# Altium schematic sheet ADC.SchDoc
size A
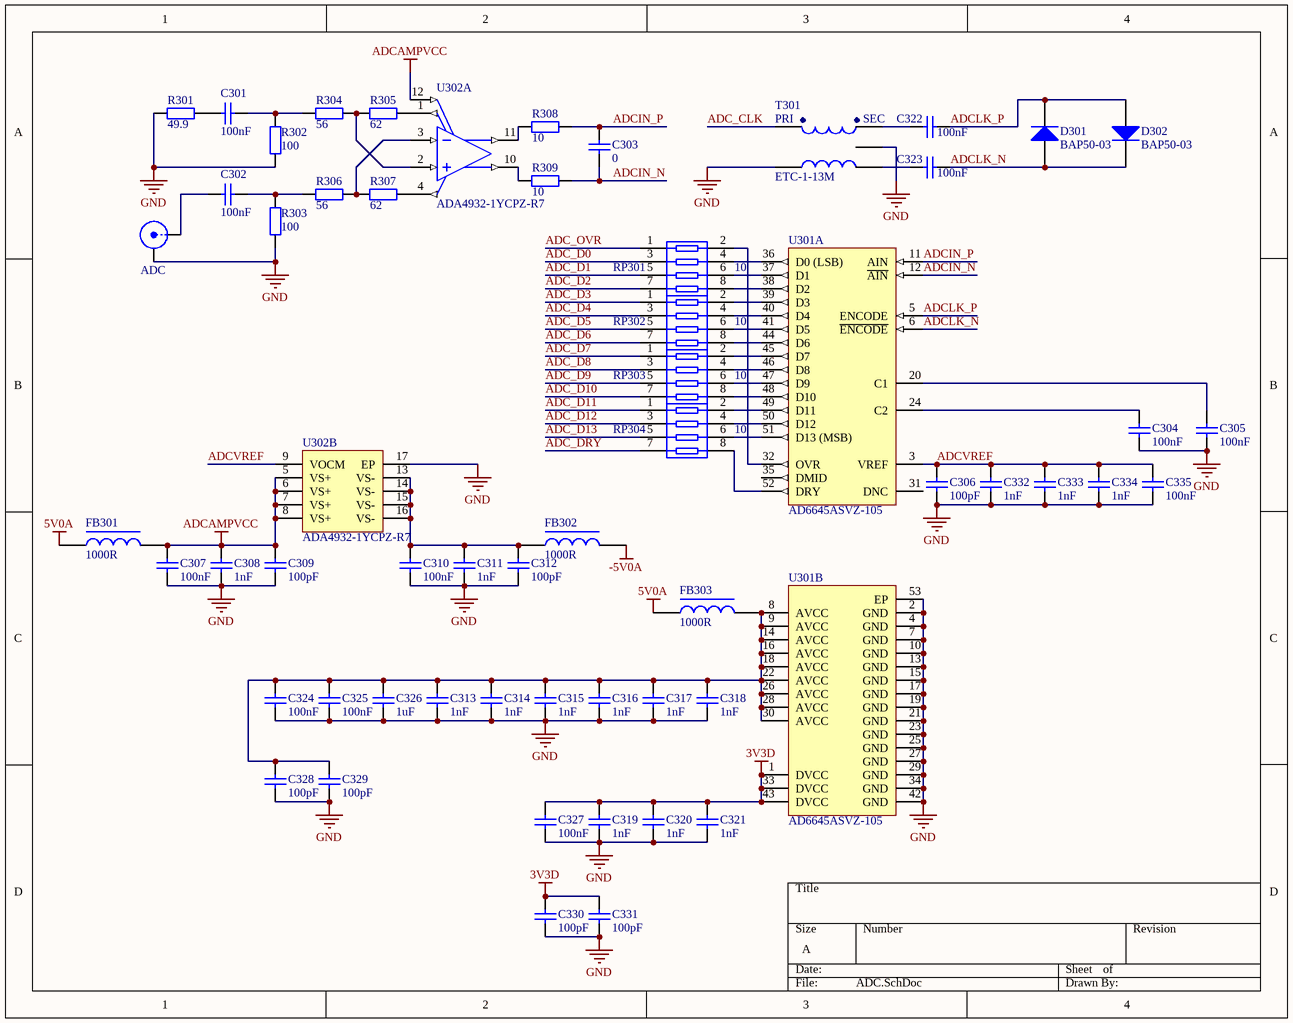
[diagram p0: ADC.SchDoc]

## Parts
ADC  SMA  [SMA-V]  (value not drawn)
C301  value 100nF  [0402C]  (hidden comment: MLCC)
C302  value 100nF  [0402C]  (hidden comment: MLCC)
C303  value 0  [0402C]  (hidden comment: MLCC)
C304  value 100nF  [0402C]  (hidden comment: MLCC)
C305  value 100nF  [0402C]  (hidden comment: MLCC)
C306  value 100pF  [0402C]  (hidden comment: MLCC)
C307  value 100nF  [0603C]  (hidden comment: MLCC)
C308  value 1nF  [0402C]  (hidden comment: MLCC)
C309  value 100pF  [0402C]  (hidden comment: MLCC)
C310  value 100nF  [0603C]  (hidden comment: MLCC)
C311  value 1nF  [0402C]  (hidden comment: MLCC)
C312  value 100pF  [0402C]  (hidden comment: MLCC)
C313  value 1nF  [0402C]  (hidden comment: MLCC)
C314  value 1nF  [0402C]  (hidden comment: MLCC)
C315  value 1nF  [0402C]  (hidden comment: MLCC)
C316  value 1nF  [0402C]  (hidden comment: MLCC)
C317  value 1nF  [0402C]  (hidden comment: MLCC)
C318  value 1nF  [0402C]  (hidden comment: MLCC)
C319  value 1nF  [0402C]  (hidden comment: MLCC)
C320  value 1nF  [0402C]  (hidden comment: MLCC)
C321  value 1nF  [0402C]  (hidden comment: MLCC)
C322  value 100nF  [0402C]  (hidden comment: MLCC)
C323  value 100nF  [0402C]  (hidden comment: MLCC)
C324  value 100nF  [0603C]  (hidden comment: MLCC)
C325  value 100nF  [0603C]  (hidden comment: MLCC)
C326  value 1uF  [0603C]  (hidden comment: MLCC)
C327  value 100nF  [0603C]  (hidden comment: MLCC)
C328  value 100pF  [0402C]  (hidden comment: MLCC)
C329  value 100pF  [0402C]  (hidden comment: MLCC)
C330  value 100pF  [0402C]  (hidden comment: MLCC)
C331  value 100pF  [0402C]  (hidden comment: MLCC)
C332  value 1nF  [0402C]  (hidden comment: MLCC)
C333  value 1nF  [0402C]  (hidden comment: MLCC)
C334  value 1nF  [0402C]  (hidden comment: MLCC)
C335  value 100nF  [0402C]  (hidden comment: MLCC)
D301  BAP50-03  [SOD323]
D302  BAP50-03  [SOD323]
FB301  value 1000R  [0603L]  (hidden comment: FerriteBead)
FB302  value 1000R  [0603L]  (hidden comment: FerriteBead)
FB303  value 1000R  [0603L]  (hidden comment: FerriteBead)
R301  value 49.9  [0402R]  (hidden comment: Resistor)
R302  value 100  [0402R]  (hidden comment: Resistor)
R303  value 100  [0402R]  (hidden comment: Resistor)
R304  value 56  [0402R]  (hidden comment: Resistor)
R305  value 62  [0402R]  (hidden comment: Resistor)
R306  value 56  [0402R]  (hidden comment: Resistor)
R307  value 62  [0402R]  (hidden comment: Resistor)
R308  value 10  [0402R]  (hidden comment: Resistor)
R309  value 10  [0402R]  (hidden comment: Resistor)
RP301  value 10  [8P4R_0402]  (hidden comment: Res Pack)
RP302  value 10  [8P4R_0402]  (hidden comment: Res Pack)
RP303  value 10  [8P4R_0402]  (hidden comment: Res Pack)
RP304  value 10  [8P4R_0402]  (hidden comment: Res Pack)
T301  ETC-1-13M  [ETC1-1-13M]
U301  AD6645ASVZ-105  [SV-52-1_N]  (parts A,B of 2)
U302  ADA4932-1YCPZ-R7  [ADI-CP-16-2_L]  (parts A,B of 2)

## Nets
3V3D: C319.2 C320.2 C321.2 C327.2 C330.2 C331.2 U301.1(DVCC) U301.33(DVCC) U301.43(DVCC)
5V0A: FB301.1 FB303.1
-5V0A: FB302.2
ADCAMPVCC: C307.2 C308.2 C309.2 FB301.2 U302.5(VS+) U302.6(VS+) U302.7(VS+) U302.8(VS+) U302.12(~{PD})
GND: ADC.2(Y) C304.1 C305.1 C306.1 C307.1 C308.1 C309.1 C310.1 C311.1 C312.1 C313.1 C314.1 C315.1 C316.1 C317.1 C318.1 C319.1 C320.1 C321.1 C324.1 C325.1 C326.1 C327.1 C328.1 C329.1 C330.1 C331.1 C332.1 C333.1 C334.1 C335.1 R301.1 R302.1 R303.1 T301.2(P) T301.4(G) U301.2(GND) U301.4(GND) U301.7(GND) U301.10(GND) U301.13(GND) U301.15(GND) U301.17(GND) U301.19(GND) U301.21(GND) U301.23(GND) U301.25(GND) U301.27(GND) U301.29(GND) U301.34(GND) U301.42(GND) U301.53(EP) U302.17(EP)
ADC_CLK: T301.1(PD)
ADC_D0: RP301.3
ADC_D1: RP301.5
ADC_D2: RP301.7
ADC_D3: RP302.1
ADC_D4: RP302.3
ADC_D5: RP302.5
ADC_D6: RP302.7
ADC_D7: RP303.1
ADC_D8: RP303.3
ADC_D9: RP303.5
ADC_D10: RP303.7
ADC_D11: RP304.1
ADC_D12: RP304.3
ADC_D13: RP304.5
ADC_DRY: RP304.7
ADC_OVR: RP301.1
ADCIN_N: C303.1 R309.2 U301.12(~{AIN})
ADCIN_P: C303.2 R308.2 U301.11(AIN)
ADCLK_N: C323.2 D301.1(A) D302.2(K) U301.6(~{ENCODE})
ADCLK_P: C322.2 D301.2(K) D302.1(A) U301.5(ENCODE)
ADCVREF: C306.2 C332.2 C333.2 C334.2 C335.2 U301.3(VREF) U302.9(VOCM)
NetADC_1: ADC.1(X) C302.1
NetC301_1: C301.1 R301.2
NetC301_2: C301.2 R302.2 R304.1
NetC302_2: C302.2 R303.2 R306.1
NetC304_2: C304.2 U301.24(C2)
NetC305_2: C305.2 U301.20(C1)
NetC310_2: C310.2 C311.2 C312.2 FB302.1 U302.13(VS-) U302.14(VS-) U302.15(VS-) U302.16(VS-)
NetC313_2: C313.2 C314.2 C315.2 C316.2 C317.2 C318.2 C324.2 C325.2 C326.2 C328.2 C329.2 FB303.2 U301.8(AVCC) U301.9(AVCC) U301.14(AVCC) U301.16(AVCC) U301.18(AVCC) U301.22(AVCC) U301.26(AVCC) U301.28(AVCC) U301.30(AVCC)
NetC322_1: C322.1 T301.5(SD)
NetC323_1: C323.1 T301.3(S)
NetR304_2: R304.2 R305.1 U302.2(IN+)
NetR305_2: R305.2 U302.1(FB-)
NetR306_2: R306.2 R307.1 U302.3(IN-)
NetR307_2: R307.2 U302.4(FB+)
NetR308_1: R308.1 U302.11(OUT-)
NetR309_1: R309.1 U302.10(OUT+)
NetRP301_2: RP301.2 U301.32(OVR)
NetRP301_4: RP301.4 U301.36(D0_(LSB))
NetRP301_6: RP301.6 U301.37(D1)
NetRP301_8: RP301.8 U301.38(D2)
NetRP302_2: RP302.2 U301.39(D3)
NetRP302_4: RP302.4 U301.40(D4)
NetRP302_6: RP302.6 U301.41(D5)
NetRP302_8: RP302.8 U301.44(D6)
NetRP303_2: RP303.2 U301.45(D7)
NetRP303_4: RP303.4 U301.46(D8)
NetRP303_6: RP303.6 U301.47(D9)
NetRP303_8: RP303.8 U301.48(D10)
NetRP304_2: RP304.2 U301.49(D11)
NetRP304_4: RP304.4 U301.50(D12)
NetRP304_6: RP304.6 U301.51(D13_(MSB))
NetRP304_8: RP304.8 U301.52(DRY)

Not connected (* = marked no-connect by the designer): U301 31(DNC) 35(DMID)

## Notes on the sheet
- (in symbol ETC-1-13M) PRI; SEC

## Library data of the parts
ADC = SMA: SMA Connector
D301 D302 = BAP50-03: Silicon PIN diode
RP301-RP304 = Res Pack: Isolated Resistor Network
T301 = ETC-1-13M: RF balun
U301 = AD6645ASVZ-105: Single 14-Bit Analog-to-Digital Converter with Parallel Interface, 105MSPS, 0 to +70 degC, SV-52-1, Pb-Free, Tray; Generic Part Number: AD6645-105; Manufacturer: Analog Devices; Resolution (Bits): 14; Channels: 1; Throughput Rate (SPS): 105M; Interface: Par; DatasheetVersion: Rev.D; PackageVersion: 072408-A; PackageReference: SV-52-1; PackageDescription: 52-Lead Thin Quad Flat Package, Exposed Pad [TQFP_EP]; Supplier 1: Digi-Key; Supplier Part Number 1: AD6645ASVZ-105-ND; Supplier 2: Farnell; Supplier Part Number 2: 2305547; Supplier 3: Newark; Supplier Part Number 3: 45P6461; Supplier 4: Mouser; Supplier Part Number 4: 584-AD6645ASVZ-105; RoHS: Y; Packing: Tray; Mounting Technology: Surface Mount; Code_JEDEC: MS-026-ACC; PartNumber: AD6645ASVZ-105; ComponentLink1Description: Manufacturer URL; ComponentLink1URL: http://www.analog.com/en/index.html; ComponentLink2Description: Datasheet; ComponentLink2URL: http://www.analog.com/static/imported-files/data_sheets/AD6645.pdf; ComponentLink3Description: Package Specification; ComponentLink3URL: SV-52-1; ComponentLink4Description: Product URL; ComponentLink4URL: http://www.analog.com/en/analog-to-digital-converters/ad-converters/ad6645/products/product.html
U302 = ADA4932-1YCPZ: Low Power Differential ADC Driver, 3 V to +/- 5 V, 9.6 mA per Amplifier, -40 to 105 degC, 16-Pin QFN (CP-16-2), RoHS, Reel; Manufacturer: Analog Devices; Slew Rate: 2800 V/us; Low Harmonic Distortion: 90 dB SFDR at 20 MHz; PackageDescription: 16-Pin Lead Frame Chip Scale Package, Body 3 x 3 mm, Pitch 0.5 mm; ComponentLink2URL: http://www.analog.com/static/imported-files/data_sheets/ADA4932-1_4932-2.pdf; Mounting Technology: Surface Mount; ComponentLink3URL: http://www.analog.com/static/imported-files/packages/PKG_PDF/LFCSP(CP)/CP_16_2.pdf; PackageVersion: Jan-05; Low Power: 9.6 mA per Amplifier; Packing: Reel; ComponentLink1Description: Manufacturer URL; RoHS: TRUE; Wide Supply Range: 3 V to +/- 5 V; ComponentLink2Description: Datasheet; PartNumber: ADA4932-1YCPZ-R7; PackageReference: CP-16-2; DatasheetVersion: Rev. C; Temperature Range: -40 to 105 degC; ComponentLink1URL: http://www.analog.com/; ComponentLink3Description: Package Specification; PartId: 1